# EAGLE design gps_sensor (EAGLE 9.2.0)
COMPANY: Fablab Santiago; DRAWN: Xavier; REV: A
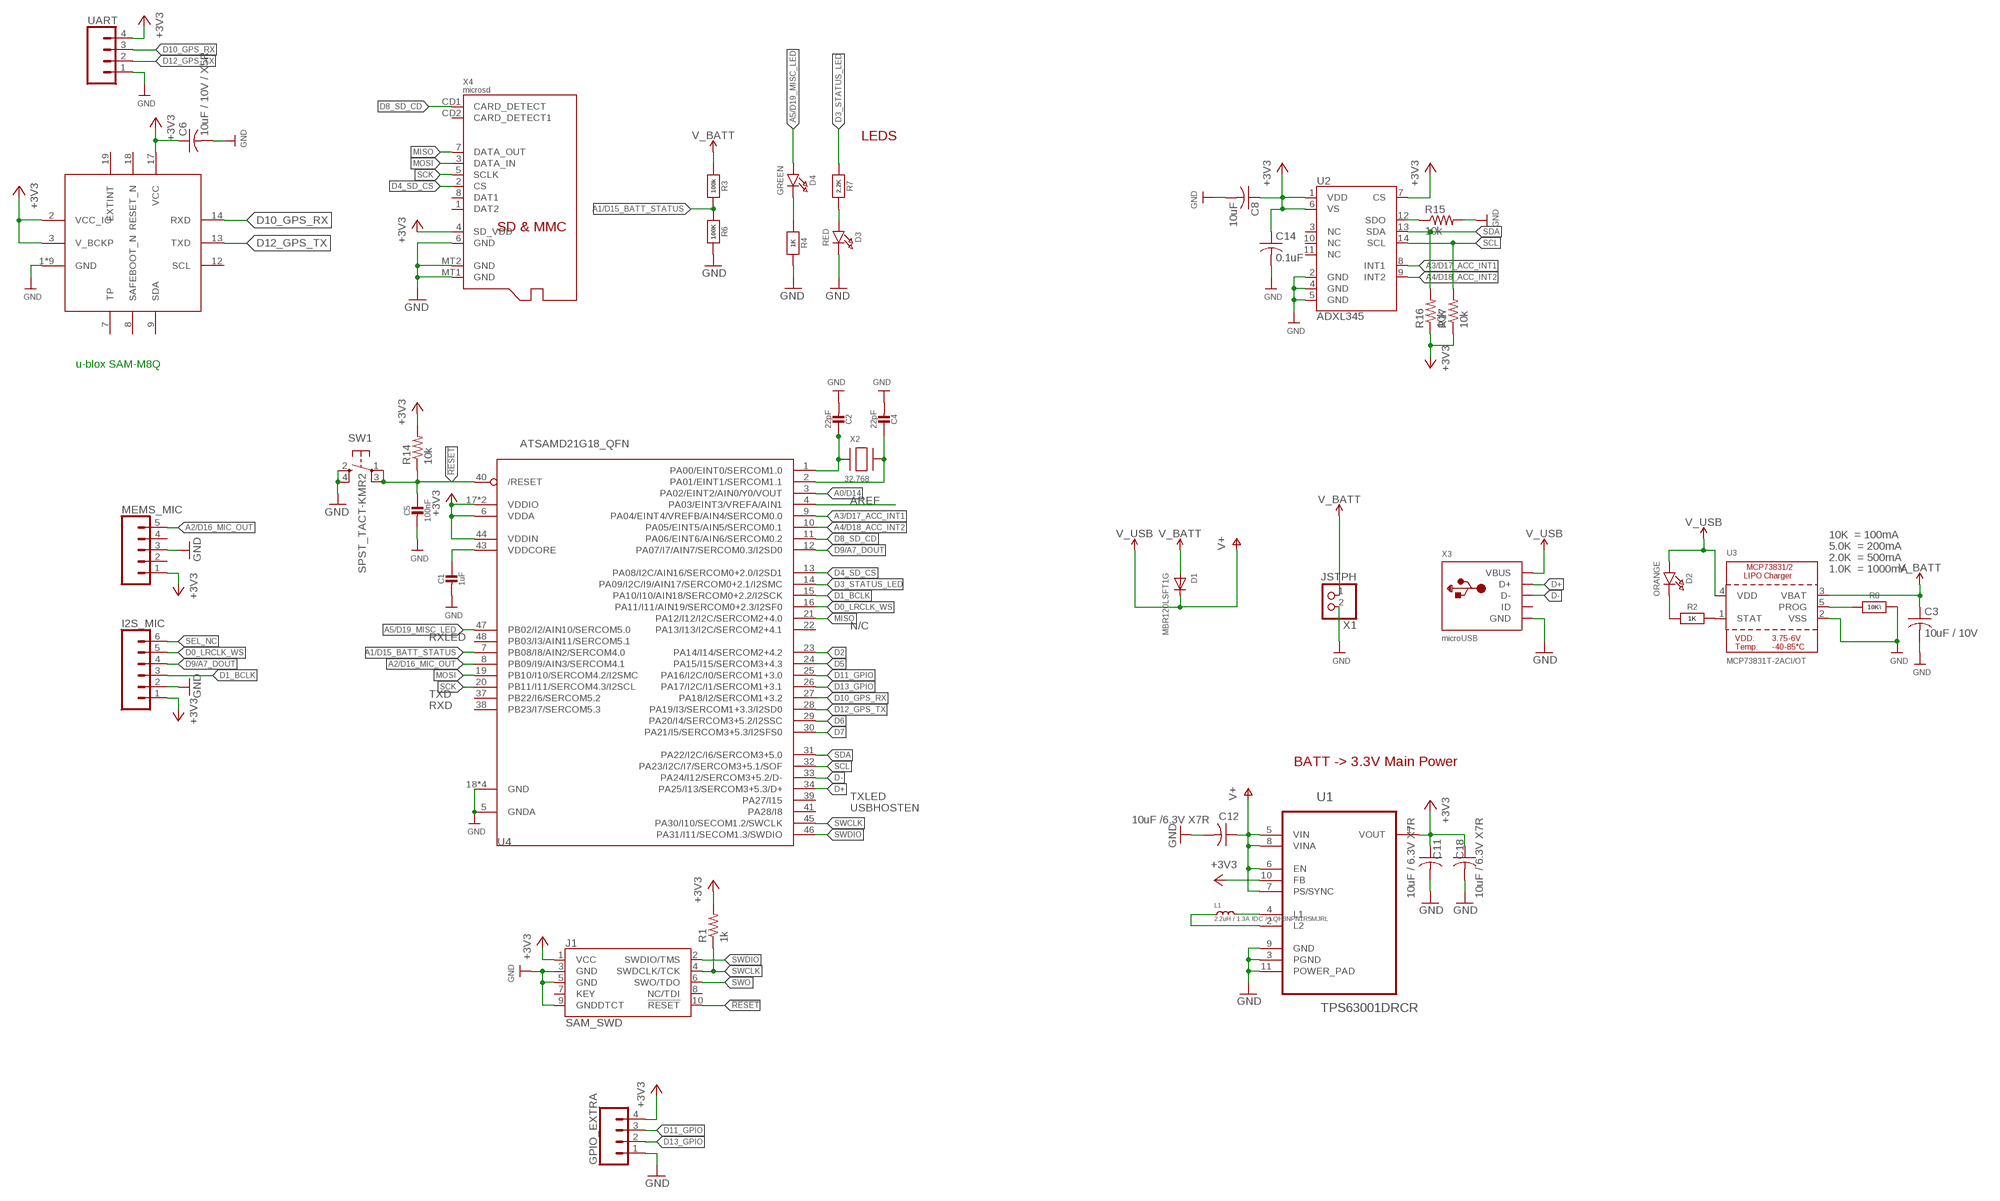
[diagram p0: schematic, sheet 1]

## Parts
C1  1uF  CAP_CERAMIC0603_NO  [0603-NO]
C2  22pF  CAP_CERAMIC0603_NO  [0603-NO]
C3  10uF / 10V  C-USC0603  [C0603]
C4  22pF  CAP_CERAMIC0603_NO  [0603-NO]
C5  100nF  CAP_CERAMIC0603_NO  [0603-NO]
C6  10uF / 10V / X5R  C-USC0603  [C0603]
C8  10uF  C-USC0603  [C0603]
C11  10uF / 6.3V X7R  C-USC0603  [C0603]
C12  10uF /6.3V X7R  C-USC0603  [C0603]
C14  0.1uF  C-USC0603  [C0603]
C18  10uF / 6.3V X7R  C-USC0603  [C0603]
D1  MBR120LSFT1G  DIODE_SOD-123FL  [SOD-123FL]
D2  ORANGE  LED0805_NOOUTLINE  [CHIPLED_0805_NOOUTLINE]
D3  RED  LED0805_NOOUTLINE  [CHIPLED_0805_NOOUTLINE]
D4  GREEN  LED0805_NOOUTLINE  [CHIPLED_0805_NOOUTLINE]
GPIO_EXTRA  CONN_04  [1X04]
I2S_MIC  CONN_06NO_SILK_NO_POP  [1X06_NO_SILK]
J1  SAM_SWD  CORTEX_DEBUG_SMD  [SAMTECH_FTSH-105-01]
L1  2.2uH / 1.3A IDC / LQH3NPN1R5MJRL  LQH3NPN___MM0  [LQH3NP_M0]
MEMS_MIC  CONN_05  [1X05]
R1  1k  R-US_R0603  [R0603]
R2  1K  RESISTOR_0603_NOOUT  [0603-NO]
R3  100k  RESISTOR_0603_NOOUT  [0603-NO]
R4  1K  RESISTOR_0603_NOOUT  [0603-NO]
R6  100K  RESISTOR_0603_NOOUT  [0603-NO]
R7  2.2K  RESISTOR_0603_NOOUT  [0603-NO]
R8  10K\  RESISTOR_0603_NOOUT  [0603-NO]
R14  10k  R-US_R0603  [R0603]
R15  10k  R-US_R0603  [R0603]
R16  10k  R-US_R0603  [R0603]
R17  10k  R-US_R0603  [R0603]
SW1  SPST_TACT-KMR2  [KMR2]
U1  TPS63001DRCR  [SON50P300X300X100-11N]
U2  ADXL345  [LGA-14]
U3  MCP73831T-2ACI/OT  MCP73831/2  [SOT23-5]
U4  ATSAMD21G18_QFN  ATSAMD21J_QFN  [TQFN48_7MM]
U5  SAM-M8Q  [SAM-M8Q]
UART  CONN_041X04_NO_SILK  [1X04_NO_SILK]
X1  JSTPH  JST_2PIN-SMT-RA  [JST-PH-2-SMT-RA]
X2  32.768  XTAL-3.2X1.5  [XTAL3215]
X3  microUSB  USB_MICRO_20329_V2  [4UCONN_20329_V2]
X4  microsd  MICROSD  [MICROSD]

## Nets
!RESET: C5.1 J1.10(!RESET) R14.1 SW1.1(P) SW1.3(P1) U4.40(/RESET)
+3V3: C6.1 C8.1 C11.1 C14.1 C18.1 GPIO_EXTRA.4 I2S_MIC.1 J1.1(VCC) MEMS_MIC.1 R1.2 R14.2 R16.1 R17.1 U1.1(VOUT) U1.10(FB) U2.1(VDD) U2.6(VS) U2.7(CS) U4.6(VDDA) U4.17(VDDIO) U4.36(VDDIO) U4.44(VDDIN) U5.2(VCC_IO) U5.3(V_BCKP) U5.17(VCC) UART.4 X4.4(SD_VDD)
A0/D14: U4.3(PA02/EINT2/AIN0/Y0/VOUT)
A1/D15_BATT_STATUS: R3.2 R6.1 U4.7(PB08/I8/AIN2/SERCOM4.0)
A2/D16_MIC_OUT: MEMS_MIC.5 U4.8(PB09/I9/AIN3/SERCOM4.1)
A3/D17_ACC_INT1: U2.8(INT1) U4.9(PA04/EINT4/VREFB/AIN4/SERCOM0.0)
A4/D18_ACC_INT2: U2.9(INT2) U4.10(PA05/EINT5/AIN5/SERCOM0.1)
A5/D19_MISC_LED: D4.A U4.47(PB02/I2/AIN10/SERCOM5.0)
AREF: U4.4(PA03/EINT3/VREFA/AIN1)
D0_LRCLK_WS: I2S_MIC.5 U4.16(PA11/I11/AIN19/SERCOM0+2.3/I2SF0)
D1_BCLK: I2S_MIC.3 U4.15(PA10/I10/AIN18/SERCOM0+2.2/I2SCK)
D2: U4.23(PA14/I14/SERCOM2+4.2)
D3_STATUS_LED: R7.1 U4.14(PA09/I2C/I9/AIN17/SERCOM0+2.1/I2SMC)
D4_SD_CS: U4.13(PA08/I2C/AIN16/SERCOM0+2.0/I2SD1) X4.2(CS)
D5: U4.24(PA15/I15/SERCOM3+4.3)
D6: U4.29(PA20/I4/SERCOM3+5.2/I2SSC)
D7: U4.30(PA21/I5/SERCOM3+5.3/I2SFS0)
D8_SD_CD: U4.11(PA06/EINT6/AIN6/SERCOM0.2) X4.CD1(CARD_DETECT)
D9/A7_DOUT: I2S_MIC.4 U4.12(PA07/I7/AIN7/SERCOM0.3/I2SD0)
D10_GPS_RX: U4.27(PA18/I2/SERCOM1+3.2) U5.14(RXD) UART.3
D11_GPIO: GPIO_EXTRA.3 U4.25(PA16/I2C/I0/SERCOM1+3.0)
D12_GPS_TX: U4.28(PA19/I3/SERCOM1+3.3/I2SD0) U5.13(TXD) UART.2
D13_GPIO: GPIO_EXTRA.2 U4.26(PA17/I2C/I1/SERCOM1+3.1)
D+: U4.34(PA25/I13/SERCOM3+5.3/D+) X3.D+
D-: U4.33(PA24/I12/SERCOM3+5.2/D-) X3.D-
GND: C1.2 C2.2 C3.2 C4.2 C5.2 C6.2 C8.2 C11.2 C12.2 C14.2 C18.2 D3.C GPIO_EXTRA.1 I2S_MIC.2 J1.3(GND) J1.5(GND) J1.9(GNDDTCT) MEMS_MIC.3 R4.2 R6.2 R8.2 R15.2 SW1.2(S) SW1.4(S1) U1.3(PGND) U1.9(GND) U1.11(POWER_PAD) U2.2(GND) U2.4(GND) U2.5(GND) U3.2(VSS) U4.5(GNDA) U4.18(GND) U4.35(GND) U4.42(GND) U4.THERMAL(GND) U5.1(GND) U5.4(GND) U5.5(GND) U5.6(GND) U5.10(GND) U5.11(GND) U5.15(GND) U5.16(GND) U5.20(GND) UART.1 X1.2 X3.BASE@1(GND) X3.BASE@2(GND) X3.GND X3.SPRT@1(GND) X3.SPRT@2(GND) X3.SPRT@3(GND) X3.SPRT@4(GND) X4.6(GND) X4.MT1(GND) X4.MT2(GND)
MISO: U4.21(PA12/I12/I2C/SERCOM2+4.0) X4.7(DATA_OUT)
MOSI: U4.19(PB10/I10/SERCOM4.2/I2SMC) X4.3(DATA_IN)
N$1: D2.C R2.1
N$2: D3.A R7.2
N$3: R2.2 U3.1(STAT)
N$4: R8.1 U3.5(PROG)
N$5: C2.1 U4.1(PA00/EINT0/SERCOM1.0) X2.P$1
N$6: D4.C R4.1
N$7: C4.1 U4.2(PA01/EINT1/SERCOM1.1) X2.P$2
N$9: L1.2 U1.4(L1)
N$10: L1.1 U1.2(L2)
N$14: R15.1 U2.12(SDO)
SCK: U4.20(PB11/I11/SERCOM4.3/I2SCL) X4.5(SCLK)
SCL: R17.2 U2.14(SCL) U4.32(PA23/I2C/I7/SERCOM3+5.1/SOF)
SDA: R16.2 U2.13(SDA) U4.31(PA22/I2C/I6/SERCOM3+5.0)
SEL_NC: I2S_MIC.6
SWCLK: J1.4(SWDCLK/TCK) R1.1 U4.45(PA30/I10/SECOM1.2/SWCLK)
SWDIO: J1.2(SWDIO/TMS) U4.46(PA31/I11/SECOM1.3/SWDIO)
SWO: J1.6(SWO/TDO)
V+: C12.1 D1.C D2.A U1.5(VIN) U1.6(EN) U1.7(PS/SYNC) U1.8(VINA) U3.4(VDD) X3.VBUS ; supply symbol labelled V_USB
V_BATT: C3.1 D1.A R3.1 U3.3(VBAT) X1.1
VDDCORE: C1.1 U4.43(VDDCORE)
Unconnected: J1.7(KEY) J1.8(NC/TDI) MEMS_MIC.2 MEMS_MIC.4 U2.3(NC) U2.10(NC) U2.11(NC) U4.22(PA13/I13/I2C/SERCOM2+4.1) U4.37(PB22/I6/SERCOM5.2) U4.38(PB23/I7/SERCOM5.3) U4.39(PA27/I15) U4.41(PA28/I8) U4.48(PB03/I3/AIN11/SERCOM5.1) U5.7(TP) U5.8(SAFEBOOT_N) U5.9(SDA) U5.12(SCL) U5.18(RESET_N) U5.19(EXTINT) X3.ID X4.1(DAT2) X4.8(DAT1) X4.CD2(CARD_DETECT1)

## Notes on the sheet
- LEDS
- u-blox SAM-M8Q
- 10K  = 100mA
- 5.0K  = 200mA
- 2.0K  = 500mA
- 1.0K  = 1000mA
- N/C
- RXLED
- TXD
- RXD
- BATT -> 3.3V Main Power
- TXLED
- USBHOSTEN

## Library data of the parts
C1 C2 C4 C5 = microbuilder:CAP_CERAMIC: Ceramic Capacitors For new designs, use the packages preceded by an '_' character since they are more reliable: The following footprints should be used on most boards: _0402 - Standard footprint for regular board layouts _0603 - Standard footprint for regular board layouts _0805 - Standard footprint for regular board layouts _1206 - Standard footprint for regular board layouts For extremely tight-pitch boards where space is at a premium, the following 'micro-pitch' footprints can be used (smaller pads, no silkscreen outline, etc.): _0402MP - Micro-pitch footprint for very dense/compact boards _0603MP - Micro-pitch footprint for very dense/compact boards _0805MP - Micro-pitch footprint for very dense/compact boards _1206MP - Micro-pitch footprint for very dense/compact boards
C3 C6 C8 C11 C12 C14 C18 = rcl:C-US: CAPACITOR, American symbol; SPICEPREFIX: C
D1 = adafruit:DIODE: Diode SMADIODE - SMA Surface Mount Package 20V 1A Schottky Diode Digikey: 641-1014-6-ND DO-1N4148 - Through Hole Small Current Diode SOD-123 20V 1 A (.5mV Vf) Schottky Diode - Digikey: MBRX120TPMSCT-ND SOD-323 10V 570mA (.38mV Vf, 3ns) Schottky Diode - Digikey: ZLLS410CT-ND SOD-523 30V 30mA Schottky Diode (RB751S-40TE61) - Digikey: RB751S-40TE61CT-ND SOT23-R/W - SOT23 Package (R = Solder Paste/Reflow Ovens, W = Hand-Soldering) BAT54Film 40V 300mA - Digikey: 497-7162-1-ND
D2-D4 = microbuilder:LED: LED 0603 - 0603 Surface Mount Package 2mA: Green LED - Low Power (3.9mcd, 2ma, 1.7Vf) - Digikey: 475-2709-2-ND Orange LED - Low Power (9.8mcd, 2ma, 1.8Vf) - Digikey: 475-1194-2-ND Red LED - Low Power (5mcd, 2ma, 1.8Vf) - Digikey: 475-1195-2-ND Yellow LED - Low Power (7mcd, 2ma, 1.8Vf) - Digikey: 475-1196-2-ND 5mA: Blue LED - Low Power (17mcd, 5ma, 2.9Vf) - Digikey: LNJ937W8CRACT-ND 0805 - 0805 Surface Mount Package 2mA: Red LED (8.8mcd, 2mA, 1.8Vf, Clear) - Low Power [Digikey: 475-2510-1-ND] Green LED (5mcd, 2mA, 1.8Vf, Clear) - Low Power [Digikey: 475-2730-1-ND] Yellow LED (11.3mcd, 2mA, 1.8Vf, Clear) - Low Power [Digikey: 475-2555-1-ND] 20mA: Red LED (104mcd, 20mA, Diffused) - LS R976 [Digikey: 475-1278-6-ND] Red LED (12mcd, 20mA, 2.0Vf, Clear) - APT2012EC [Digikey: 754-1128-1-ND] Green LED (15mcd, 20mA, 2.2Vf, Clear) - APT2012GC [Digikey: 754-1131-1-ND] Orange LED (160mcd, 20mA, 2.1Vf, Clear) - APT2012SECK [Digikey: 754-1130-1-ND] 1206 - 1206 Surface Mount Package Green LED (26mcd, 20mA, Diffused) - LG N971 [Digikey: 475-1407-6-ND] Red LED (15mcd, 20mA, Diffused) - LH N974 [Digikey: 475-1416-6-ND] Cree - Cree High-Power Surface Mount LEDs XPEBWT-L1-0000-00D50 - White 111lm 350mA 2.9Vf 6200K 110° XTEAWT-00-0000-00000LEE3 - White 114lm 350mA 2.85Vf 5000K 115° Everlight - Everlight 45-21 Series Surface Mount LEDs 45-21/QK2C-B2832AC2CB2/2T - Warm White 2000mcd 20mA 3.25Vf 3050K 120° 45-21/LK2C-B38452C4CB2/2T - Nuetral White 2000mcd 20mA 3.25Vf 4150K 120° 45-21/LK2C-B50634C6CB2/2T - Cold White 2200mcd 20mA 3.25Vf 5650K 120° PLCC2 Reverse Mount LS T77K-J1L2-1-0-2-R18-Z - Red 11.25mcd 2mA 1.8Vf 630nm 120° LO T77K-L1M2-24-Z - Orange 19.6mcd 2mA 1.8Vf 606nm 120° LY T77K-K2M1-26-Z - Yellow 15.7mcd 2mA 1.8Vf 587nm 120°
GPIO_EXTRA UART = SparkFun-Connectors:CONN_04: Multi connection point. Often used as Generic Header-pin footprint for 0.1 inch spaced/style header connections On any of the 0.1 inch spaced packages, you can populate with these: Break Away Headers - Straight <https://www.sparkfun.com/products/116> (PRT-00116) Break Away Male Headers - Right Angle <https://www.sparkfun.com/products/553> (PRT-00553) Female Headers <https://www.sparkfun.com/products/115> (PRT-00115) Break Away Headers - Machine Pin <https://www.sparkfun.com/products/117> (PRT-00117) Break Away Female Headers - Swiss Machine Pin <https://www.sparkfun.com/products/743> (PRT-00743) For SCREWTERMINALS and SPRING TERMINALS visit here: Screw Terimnals on SparkFun.com <https://www.sparkfun.com/search/results?term=Screw+Terminals> (5mm/3.5mm/2.54mm spacing) This device is also useful as a general connection point to wire up your design to another part of your project. Our various solder wires solder well into these plated through hole pads. Hook-Up Wire - Assortment (Stranded, 22 AWG) <https://www.sparkfun.com/products/11375> (PRT-11375) Hook-Up Wire - Assortment (Solid Core, 22 AWG) <https://www.sparkfun.com/products/11367> (PRT-11367) View the entire wire category on our website here <https://www.sparkfun.com/categories/141> Special notes: Molex polarized connector foot print use with SKU : PRT-08231 with associated crimp pins and housings. 1MM SMD Version SKU: PRT-10208; PROD_ID: CONN-09696
I2S_MIC = SparkFun-Connectors:CONN_06: Multi connection point. Often used as Generic Header-pin footprint for 0.1 inch spaced/style header connections On any of the 0.1 inch spaced packages, you can populate with these: Break Away Headers - Straight <https://www.sparkfun.com/products/116> (PRT-00116) Break Away Male Headers - Right Angle <https://www.sparkfun.com/products/553> (PRT-00553) Female Headers <https://www.sparkfun.com/products/115> (PRT-00115) Break Away Headers - Machine Pin <https://www.sparkfun.com/products/117> (PRT-00117) Break Away Female Headers - Swiss Machine Pin <https://www.sparkfun.com/products/743> (PRT-00743) Arduino Stackable Header - 6 Pin <https://www.sparkfun.com/products/9280> (PRT-09280) For SCREWTERMINALS and SPRING TERMINALS visit here: Screw Terimnals on SparkFun.com <https://www.sparkfun.com/search/results?term=Screw+Terminals> (5mm/3.5mm/2.54mm spacing) This device is also useful as a general connection point to wire up your design to another part of your project. Our various solder wires solder well into these plated through hole pads. Hook-Up Wire - Assortment (Stranded, 22 AWG) <https://www.sparkfun.com/products/11375> (PRT-11375) Hook-Up Wire - Assortment (Solid Core, 22 AWG) <https://www.sparkfun.com/products/11367> (PRT-11367) View the entire wire category on our website here <https://www.sparkfun.com/categories/141>
J1 = SparkFun-Connectors:CORTEX_DEBUG: Cortex Debug Connector - 10 pin Supports JTAG debug, Serial Wire debug, and Serial Wire Viewer. PTH and SMD connector options available. General Connector Information <http://infocenter.arm.com/help/topic/com.arm.doc.faqs/attached/13634/cortex_debug_connectors.pdf> Products: PTH Connector <http://www.digikey.com/product-detail/en/cnc-tech/3220-10-0100-00/1175-1627-ND/3883661> -via Digi-Key SparkFun PSoc <https://www.sparkfun.com/products/13229> SparkFun T <https://www.sparkfun.com/products/13810>
L1 = murata:LQH3NPN___MM0
MEMS_MIC = SparkFun-Connectors:CONN_05: Multi connection point. Often used as Generic Header-pin footprint for 0.1 inch spaced/style header connections On any of the 0.1 inch spaced packages, you can populate with these: Break Away Headers - Straight <https://www.sparkfun.com/products/116> (PRT-00116) Break Away Male Headers - Right Angle <https://www.sparkfun.com/products/553> (PRT-00553) Female Headers <https://www.sparkfun.com/products/115> (PRT-00115) Break Away Headers - Machine Pin <https://www.sparkfun.com/products/117> (PRT-00117) Break Away Female Headers - Swiss Machine Pin <https://www.sparkfun.com/products/743> (PRT-00743) For SCREWTERMINALS and SPRING TERMINALS visit here: Screw Terimnals on SparkFun.com <https://www.sparkfun.com/search/results?term=Screw+Terminals> (5mm/3.5mm/2.54mm spacing) This device is also useful as a general connection point to wire up your design to another part of your project. Our various solder wires solder well into these plated through hole pads. Hook-Up Wire - Assortment (Stranded, 22 AWG) <https://www.sparkfun.com/products/11375> (PRT-11375) Hook-Up Wire - Assortment (Solid Core, 22 AWG) <https://www.sparkfun.com/products/11367> (PRT-11367) View the entire wire category on our website here <https://www.sparkfun.com/categories/141> Special notes: Molex polarized connector foot print use with SKU : PRT-08231 with associated crimp pins and housings. 1MM SMD Version SKU: PRT-10208
R1 R14-R17 = rcl:R-US_: RESISTOR, American symbol; SPICEPREFIX: R
R2-R4 R6-R8 = microbuilder:RESISTOR: Resistors For new designs, use the packages preceded by an '_' character since they are more reliable: The following footprints should be used on most boards: _0402 - Standard footprint for regular board layouts _0603 - Standard footprint for regular board layouts _0805 - Standard footprint for regular board layouts _1206 - Standard footprint for regular board layouts For extremely tight-pitch boards where space is at a premium, the following 'micro-pitch' footprints can be used (smaller pads, no silkscreen outline, etc.): _0402MP - Micro-pitch footprint for very dense/compact boards _0603MP - Micro-pitch footprint for very dense/compact boards _0805MP - Micro-pitch footprint for very dense/compact boards _1206MP - Micro-pitch footprint for very dense/compact boards
SW1 = adafruit:SPST_TACT: SMT 6mm switch, EVQQ2 series http://www.ladyada.net/library/eagle
U1 = Texas Instruments_By_element14_Batch_1:TPS63001DRCR: HIGH EFFICIENT SINGLE INDUCTOR BUCK-BOOST CONVERTER WITH 1.8-A SWITCHES; MPN: TPS63001DRCR; OC_FARNELL: -; OC_NEWARK: 85K1711; PACKAGE: SON-10; SUPPLIER: TEXAS INSTRUMENTS
U2 = SparkFun-Sensors:ADXL345: Analog Devices ADXL345 3-Axis SPI/I2C 2/4/8/16g Accelerometer The ADXL345 is a small, thin, low power, 3-axis accelerometer with high resolution (13-bit) measurement at up to ±16g. Digital output data is formatted as 16-bit twos complement and is accessible through either a SPI (3- or 4-wire) or I2C digital interface. Datasheet <https://www.sparkfun.com/datasheets/Sensors/Accelerometer/ADXL345.pdf> SparkFun Products SparkFun Triple Axis Accelerometer Breakout - ADXL345 <https://www.sparkfun.com/products/9836> (SEN-09836) Triple Axis Accelerometer - ADXL345 <https://www.sparkfun.com/products/9045> (SEN-09045) SparkFun 6 Degrees of Freedom IMU Digital Combo Board - ITG3200/ADXL345 <https://www.sparkfun.com/products/10121> (SEN-10121); PROD_ID: IC-09097; SF_ID: SEN-09045
U3 = microbuilder:MCP73831/2: MCP73831/2 LIPO Charger VDD: 3.75 - 6V Temp -40 - 85°C Programmable Charge Rate: 15-500mA NOTE: STAT is a tri-state logic output on the MCP73831 and an open-drain output on the MCP73832. SOT23-5 with 4.2V output and tri-state logic on STAT = MCP73831T-2ACI/OT
U4 = microbuilder:ATSAMD21J
U5 = ubloxLib:SAM-M8Q: u-blox SAM GNSS antenna module
X1 = adafruit:JST_2PIN: JST 2-Pin Connectors of various flavors SMT-RA (S2B-PH-SM4) 4UConnector #17311 SMT (B2B-PH-SM4) THM-RA (S2B-PH) THM (B2B-PH)
X2 = adafruit2:XTAL: Low cost SMT crystals, no capacitors included http://www.ladyada.net/library/eagle
X3 = microbuilder:USB: USB Connectors USBMINIB - Surface Mount Female Mini-B USB Connector 4UConnector: 06564
X4 = microbuilder:MICROSD: MicroSD/Transflash Card Holder with SPI pinout 3M: 2908-05WB-MG 4UConnector: 19656 Footprint courtesy: Adafruit Industries

## Board
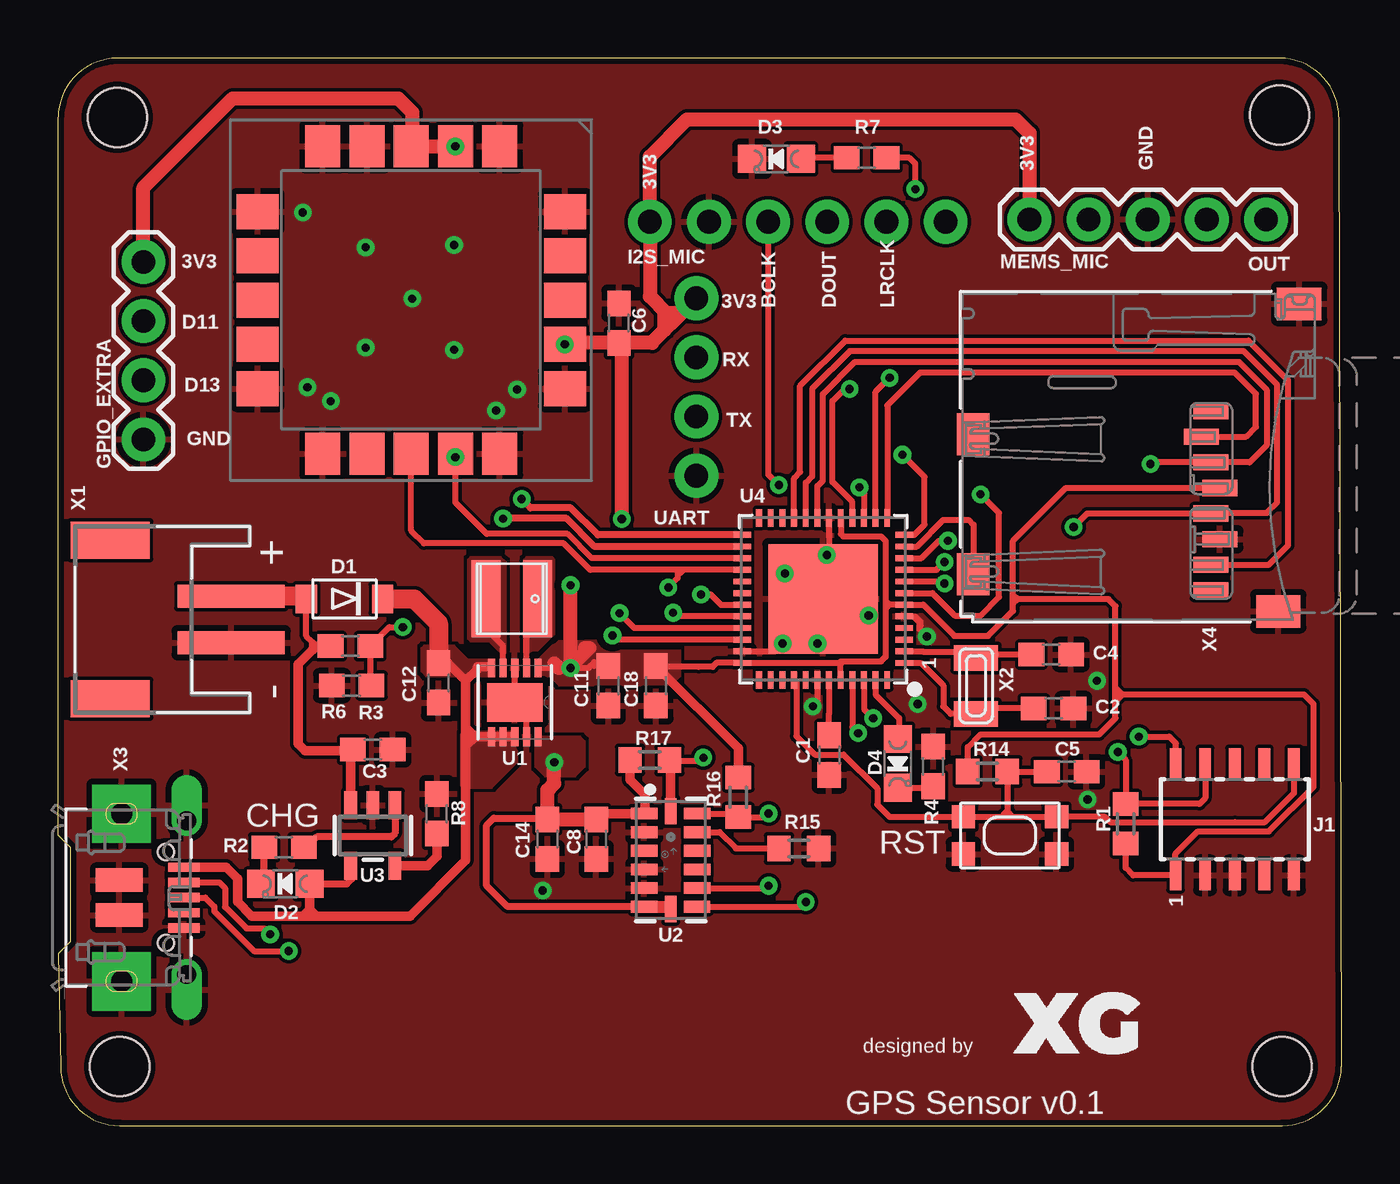
[diagram p1: board, top side]
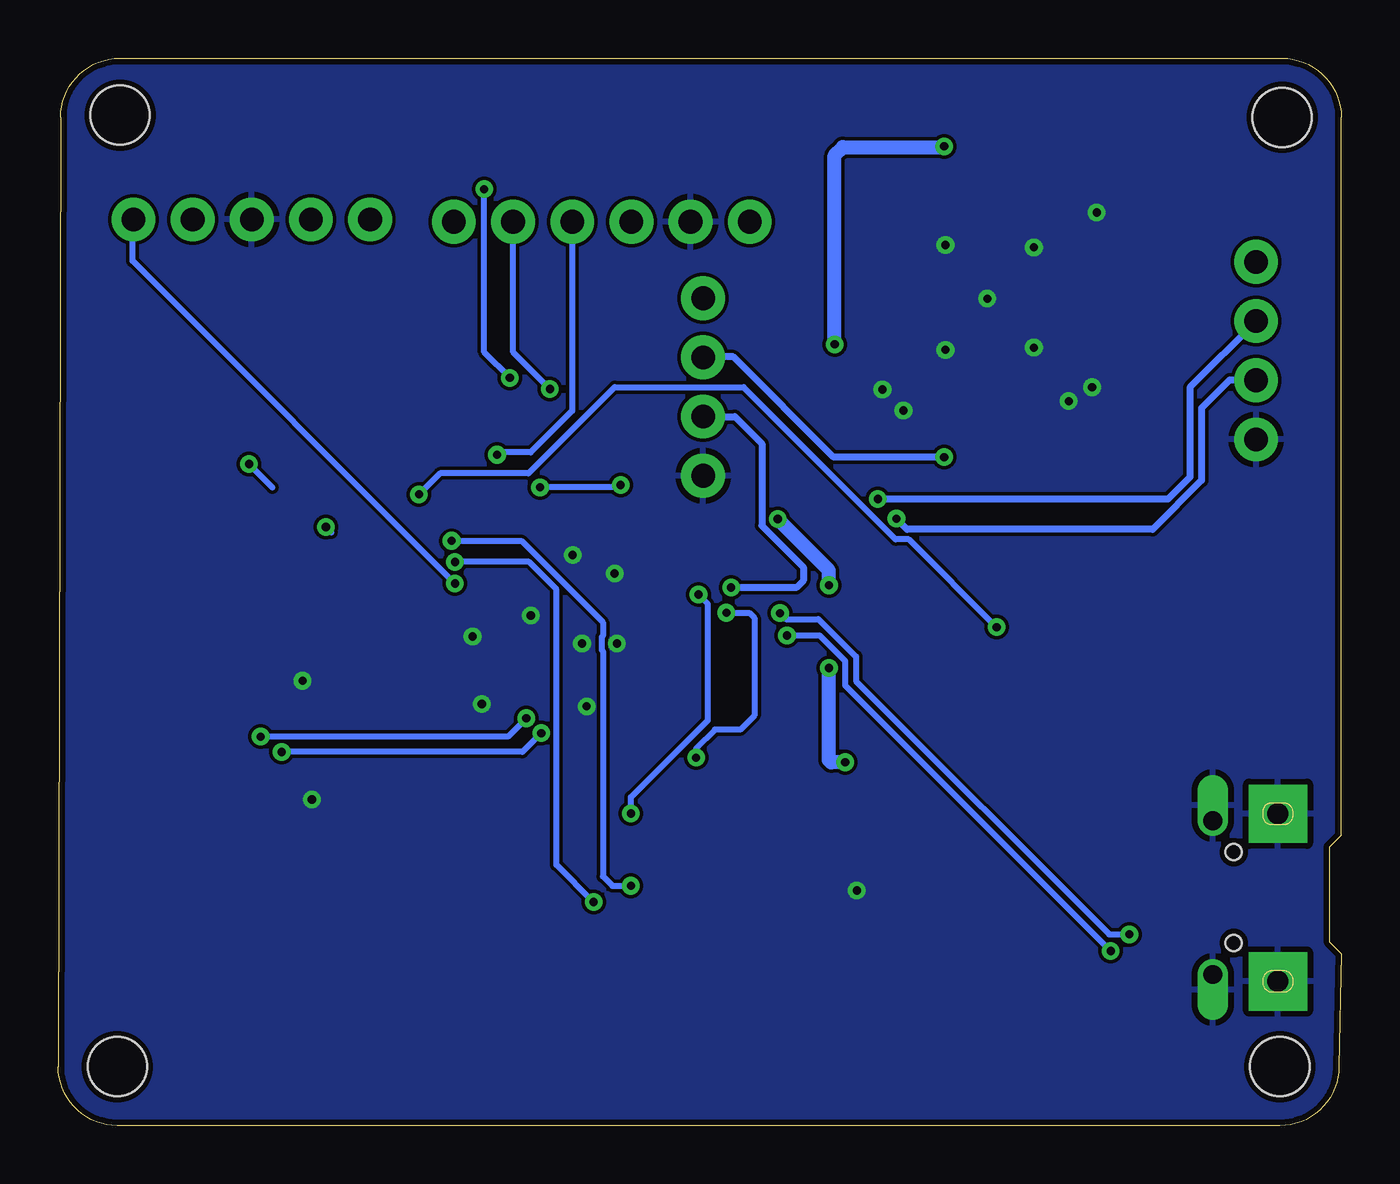
[diagram p2: board, bottom side, seen from below]

Size 55.09 x 45.82 mm. Coordinates in mm from the lower left corner, seen from the top.
Outline: 2.64,0 52.55,0 arc90 55.09,2.54 54.99,43.28 arc90 52.45,45.82 2.54,45.82 arc90 0,43.28 0,12.47 0.51,11.96 0.51,7.9 0,7.39 0.1,2.54 arc90 2.64,0
Copper layers (1*16): Top 0.035mm / dielectric 1.5mm / Bottom 0.035mm
Design rules "adafruit *": minimum track width 10mil, minimum drill 0.3mm, track to track 0.15mm, track to pad 0.15mm, pad to pad 0.15mm, via to via 0.15mm, smd to smd 0.15mm, copper to edge 10mil, drill to drill 8mil, minimum pad ring 10mil, minimum via ring 8mil, stop-mask expansion 2mil, vias tented up to drill 20mil, thermal gap 10mil
Holes 2.54 mm at 52.55,2.54 2.54,43.28 2.64,2.54 52.44,43.38

### Footprints (pad centres in the part's own frame; a part is rotated, then mirrored left to right if it is on the bottom)
0603-NO = smd 1.1 x 1: 1 -0.85,0; 2 0.85,0
C0603 = smd 1.1 x 1: 1 -0.85,0; 2 0.85,0
SOD-123FL = smd 0.91 x 1.22: A 1.637,0; C -1.637,0
CHIPLED_0805_NOOUTLINE = smd 1.2 x 1.2: A 0,-1.05; C 0,1.05
1X04 = drill 1.016 pad 1.88: 1 0,0; 2 2.54,0; 3 5.08,0; 4 7.62,0
1X06_NO_SILK = drill 1.016 pad 1.88: 1 0,0; 2 2.54,0; 3 5.08,0; 4 7.62,0; 5 10.16,0; 6 12.7,0
SAMTECH_FTSH-105-01 = smd 0.508 x 1.27: 1 -2.54,-2.413; 2 -2.54,2.413; 3 -1.27,-2.413; 4 -1.27,2.413; 5 0,-2.413; 6 0,2.413; 7 1.27,-2.413; 8 1.27,2.413; 9 2.54,-2.413; 10 2.54,2.413
LQH3NP_M0 = smd 1.25 x 3.3: 1 -1.1,0; 2 1.1,0
1X05 = drill 1.016 pad 1.88: 1 0,0; 2 2.54,0; 3 5.08,0; 4 7.62,0; 5 10.16,0
R0603 = smd 1 x 1.1: 1 -0.85,0; 2 0.85,0
KMR2 = smd 1 x 1: 1 2,0.8; 2 2,-0.8; 3 -2,0.8; 4 -2,-0.8
SON50P300X300X100-11N = smd 0.813 x 0.305: 1 -1.473,0.991; 2 -1.473,0.508; 3 -1.473,0; 4 -1.473,-0.508; 5 -1.473,-0.991; 6 1.473,-0.991; 7 1.473,-0.508; 8 1.473,0; 9 1.473,0.508; 10 1.473,0.991 | smd 1.651 x 2.388: 11 0,0
LGA-14 = smd 0.5 x 1.124: 1 2,1.138; 2 1.2,1.138; 3 0.4,1.138; 4 -0.4,1.138; 5 -1.2,1.138; 6 -2,1.138; 8 -2,-1.13; 9 -1.2,-1.138; 10 -0.4,-1.138; 11 0.4,-1.138; 12 1.2,-1.138; 13 2,-1.138 | smd 1.124 x 0.5: 7 -2.1,0; 14 2.1,0
SOT23-5 = smd 0.55 x 1.2: 1 -0.95,-1.3; 2 0,-1.3; 3 0.95,-1.3; 4 0.95,1.3; 5 -0.95,1.3
TQFN48_7MM = smd 0.25 x 0.75: 1 -2.75,-3.475; 2 -2.25,-3.475; 3 -1.75,-3.475; 4 -1.25,-3.475; 5 -0.75,-3.475; 6 -0.25,-3.475; 7 0.25,-3.475; 8 0.75,-3.475; 9 1.25,-3.475; 10 1.75,-3.475; 11 2.25,-3.475; 12 2.75,-3.475; 25 2.75,3.475; 26 2.25,3.475; 27 1.75,3.475; 28 1.25,3.475; 29 0.75,3.475; 30 0.25,3.475; 31 -0.25,3.475; 32 -0.75,3.475; 33 -1.25,3.475; 34 -1.75,3.475; 35 -2.25,3.475; 36 -2.75,3.475 | smd 0.75 x 0.25: 13 3.475,-2.75; 14 3.475,-2.25; 15 3.475,-1.75; 16 3.475,-1.25; 17 3.475,-0.75; 18 3.475,-0.25; 19 3.475,0.25; 20 3.475,0.75; 21 3.475,1.25; 22 3.475,1.75; 23 3.475,2.25; 24 3.475,2.75; 37 -3.475,2.75; 38 -3.475,2.25; 39 -3.475,1.75; 40 -3.475,1.25; 41 -3.475,0.75; 42 -3.475,0.25; 43 -3.475,-0.25; 44 -3.475,-0.75; 45 -3.475,-1.25; 46 -3.475,-1.75; 47 -3.475,-2.25; 48 -3.475,-2.75 | smd 4.7 x 4.7: THERMAL 0,0
SAM-M8Q = smd 1.8 x 1.5: 1 -6.6,3.8; 2 -6.6,1.9; 3 -6.6,0; 4 -6.6,-1.9; 5 -6.6,-3.8; 11 6.6,-3.8; 12 6.6,-1.9; 13 6.6,0; 14 6.6,1.9; 15 6.6,3.8 | smd 1.5 x 1.8: 6 -3.8,-6.6; 7 -1.9,-6.6; 8 0,-6.6; 9 1.9,-6.6; 10 3.8,-6.6; 16 3.8,6.6; 17 1.9,6.6; 18 0,6.6; 19 -1.9,6.6; 20 -3.8,6.6
1X04_NO_SILK = drill 1.016 pad 1.88: 1 0,0; 2 2.54,0; 3 5.08,0; 4 7.62,0
JST-PH-2-SMT-RA = smd 1 x 4.6: 1 1,-3.7; 2 -1,-3.7 | smd 1.6 x 3.4: NC1 -3.4,1.5; NC2 3.4,1.5
XTAL3215 = smd 1.1 x 1.9: P$1 1.2,0; P$2 -1.2,0
4UCONN_20329_V2 = smd 1 x 2: BASE@1 -0.75,-2; BASE@2 0.75,-2 | smd 0.4 x 1.35: D+ 0,0.775; D- -0.65,0.775; GND 1.3,0.775; ID 0.65,0.775; VBUS -1.3,0.775 | drill 0.8 pad 1.2 offset: SPRT@1 -3.3,0.9; SPRT@2 3.3,0.9 | drill 0.9 pad 2.5 square: SPRT@3 -3.6,-1.9; SPRT@4 3.6,-1.9 | hole 0.7: -1.95,0; 1.95,0
MICROSD = smd 0.7 x 1.5: 1 9,-10.64; 2 7.9,-10.24; 3 6.8,-10.64; 4 5.7,-11.04; 5 4.6,-10.64; 6 3.5,-11.04; 7 2.4,-10.64; 8 1.3,-10.64 | smd 1.8 x 1.4: CD1 2,-0.44; CD2 8,-0.44 | smd 1.4 x 1.9: MT1 0.4,-13.54; MT2 13.6,-14.44

### Placement (x,y rotation side)
C1  33.1,15.91 270 top
C2  42.73,17.91 0 top
C3  13.51,16.14 0 top
C4  42.63,20.22 0 top
C5  43.3,15.2 0 top
C6  24.08,34.45 90 top
C8  23.1,12.3 270 top
C11  23.62,18.89 270 top
C12  16.33,19.01 270 top
C14  21,12.3 270 top
C18  25.66,18.89 270 top
D1  12.29,22.62 180 top
D2  9.75,10.38 90 top
D3  30.84,41.5 90 top
D4  36.05,15.55 180 top
GPIO_EXTRA  3.66,29.46 90 top
I2S_MIC  25.4,38.8 0 top
J1  50.52,13.16 0 top
L1  19.48,22.62 180 top
MEMS_MIC  41.7,38.9 0 top
R1  45.84,12.96 270 top
R2  9.7,11.95 0 top
R3  12.55,20.59 0 top
R4  37.57,15.42 90 top
R6  12.6,18.89 180 top
R7  34.71,41.55 180 top
R8  16.26,13.39 90 top
R14  39.9,15.2 180 top
R15  31.8,11.9 0 top
R16  29.2,14.1 270 top
R17  25.4,15.7 0 top
SW1  40.86,12.46 0 top
U1  19.6,18.18 270 top
U2  26.3,11.4 90 top
U3  13.51,12.46 180 top
U4  32.84,22.61 90 top
U5  15.15,35.44 270 top
UART  27.4,27.9 90 top
X1  3.73,21.73 90 top
X2  39.41,18.88 270 top
X3  4.62,9.79 270 top
X4  38.84,21.68 90 top

### Tracks (layer width: path | path; a pad name or v marks a point on that pad's centre or on a via)
!RESET
  Top 0.254: C5.1 R14.1 40.75,13.51 | 40.6,13.26 SW1.3 35.7,13.26 35.17,13.79 35.17,14.48 33.72,15.93 32.49,15.93 31.69,16.73 31.69,19.04 U4.40 | 40.6,13.26 40.8,13.26 | 40.8,13.26 41,13.26 | 41,13.26 SW1.1 44.95,13.26 45.17,13.04 50.53,13.04 51.82,13.04 53.07,14.29 53.07,15.56 J1.10 | 40.75,13.51 40.75,13.31 40.8,13.26 | 40.75,13.51 41,13.26 | 40.75,13.51 40.6,13.36 40.6,13.26
+3V3  (via drill 0.35)
  Top 0.254: 23.03,19.74 23.03,19.9 22.78,19.65 v22,19.65 21.5,19.65 U1.1 | U1.10 | U4.44 33.59,19.8 33.6,19.8 33.54,19.86 | 33.54,19.86 U4.36 28.26,19.86 28.09,19.69 27.51,19.69 27.5,19.7 25.7,19.7 C18.1 | 33.54,19.86 33.61,19.93 35.33,19.93 35.52,20.12 35.52,22.2 | U4.17 33.6,25.4 33.71,25.29 35.33,25.29 35.52,25.1 35.52,22.54 | 35.52,22.54 35.52,22.4 | 35.52,22.4 35.52,22.2 | 35.52,22.4 35.56,22.36 35.69,22.36 | 35.7,22.36 U4.6 37.14,22.36 38.47,21.03 39.93,21.03 41,22.1 41,22.4 | 35.52,22.54 35.7,22.36 | 35.52,22.2 35.69,22.36 | 35.69,22.36 35.7,22.36 | X4.4 43.27,27.38 41,25.1 41,22.8 | 41,22.4 41,22.6 | 41,22.6 41,22.8 | R14.2 39.05,16.25 39.6,16.8 44.7,16.8 45.4,17.5 45.4,18.2 | 41.2,22.6 45.1,22.6 45.4,22.3 45.4,18.8 | 41.2,22.6 41,22.6 | 45.4,18.2 45.4,18.5 | 45.4,18.5 45.4,18.8 | 41,22.4 41.2,22.6 | 41,22.8 41.2,22.6 | R1.2 45.84,11.06 46.15,10.75 J1.1 47.98,11.68 48.93,12.63 51.98,12.63 53.9,14.55 53.9,18.1 53.5,18.5 45.7,18.5 | 45.7,18.5 45.4,18.5 | 45.4,18.8 45.7,18.5 | 45.4,18.2 45.7,18.5
  Top 0.305: U2.6 19.3,9.4 18.4,10.3 18.4,12.9 18.7,13.2 20.95,13.2 C14.1
  Top 0.406: C8.1 23.35,13.4 U2.1 25.2,13.44 25.2,14.2 24.55,14.85 R17.1 | 25.7,19.7 29.2,16.2 R16.1
  Top 0.508: U2.6 26.2,9.4 U2.7
  Top 0.61: U5.2 U5.3 15.2,42.08 15.2,43.5 14.6,44.1 7.5,44.1 3.66,40.26 GPIO_EXTRA.4 | v21.3,15.6 21.3,14.7 21,14.4 C14.1 C8.1 | 22.6,20.5 22.8,20.5 22,19.7 v22,19.65 v22,23.2 | 21.3,19.85 21.5,19.65 | C6.1 21.82,33.6 U5.17 | v24.2,26.04 24.2,33.48 C6.1 | C6.1 25.5,33.6 25.5,33.62 26.04,34.16 | UART.4 26.78,34.9 | 26.78,34.9 26.44,34.56 | 26.44,34.56 26.04,34.16 | 26.1,34.9 25.4,35.6 I2S_MIC.1 25.4,41.6 27,43.2 41.1,43.2 41.7,42.6 MEMS_MIC.1 | 26.1,34.9 26.44,34.56 | 26.04,34.16 26.04,34.84 26.1,34.9 | 26.1,34.9 26.78,34.9
  Bottom 0.254: 21.9,15.6 22,15.7
  Bottom 0.61: v21.3,15.6 21.9,15.6 | 22,15.7 v22,19.65 | U5.17 21.75,41.65 21.4,42 17.09,42 U5.2 | v22,23.2 22,23.84 v24.2,26.04
  other vias: 21.75,33.54 17.05,42.04
  pour Top (isolate 0.305, no thermals): 20.5,19.4 20.5,19.9 21.4,20.8 21.7,20.8 26.2,20.9 26.7,20.4 26.7,19.3 26.3,18.9 21.5,18.9 21.1,19.3 20.6,19.3
  pour Top (no thermals): 20.5,16.7 20.5,15.4 20.9,15 22.2,15 22.6,15.4 22.6,16.5 22.4,16.7
A1/D15_BATT_STATUS  (via drill 0.35)
  Top 0.254: R6.1 13.4,18.95 R3.2 14.21,21.4 v14.8,21.4 | U4.7 37.54,22.86 38.5,21.9 39.6,21.9 40.4,22.7 40.4,26.3 v39.6,27.1
  Bottom 0.254: v14.8,21.4 18.57,25.17 19.14,25.17 25.67,31.7 31.2,31.7 34.9,28 38.7,28 v39.6,27.1
A2/D16_MIC_OUT  (via drill 0.35)
  Top 0.254: U4.8 37.97,23.36 v38.05,23.27
  Bottom 0.254: v38.05,23.27 51.9,37.12 51.9,38.86 MEMS_MIC.5
A3/D17_ACC_INT1  (via drill 0.35)
  Top 0.254: U4.9 37.72,23.86 v38.05,24.2 | U2.8 31.9,9.4 v32.1,9.6
  Bottom 0.254: v32.1,9.6 33.7,11.2 33.7,23.02 34.87,24.2 v38.05,24.2
A4/D18_ACC_INT2  (via drill 0.35)
  Top 0.254: U4.10 37.06,24.36 37.81,25.11 v38.2,25.11 | U2.9 30.4,10.2 v30.5,10.3
  Bottom 0.254: v38.2,25.11 35.21,25.11 31.7,21.6 31.7,21.03 31.76,20.97 31.76,20.43 31.7,20.37 31.7,10.7 31.3,10.3 v30.5,10.3
A5/D19_MISC_LED
  Top 0.254: U4.47 35.09,18.5 36.1,17.5 36.1,16.65 D4.A
D0_LRCLK_WS  (via drill 0.35)
  Top 0.254: U4.16 34.09,26.78 33.23,27.64 33.23,31.1 33.76,31.62 v33.98,31.62
  Bottom 0.254: v33.98,31.62 35.56,33.2 I2S_MIC.5
D1_BCLK  (via drill 0.35)
  Top 0.254: I2S_MIC.3 30.48,27.96 v30.94,27.5 | v34.4,27.4 34.59,27.2 U4.15
  Bottom 0.254: v30.94,27.5 31.04,27.4 v34.4,27.4
D3_STATUS_LED  (via drill 0.35)
  Top 0.254: U4.14 35.09,31.5 v35.7,32.1 | v36.8,40.2 36.8,41.3 36.55,41.55 R7.1
  Bottom 0.254: v35.7,32.1 36.8,33.2 v36.8,40.2
D4_SD_CS
  Top 0.254: X4.2 51,29.57 51.43,30 51.43,31.41 50.51,32.33 37,32.33 35.59,30.92 U4.13
D8_SD_CD
  Top 0.254: U4.11 36.86,24.86 38,26 39.1,26 39.3,25.8 39.3,23.69 X4.CD1
D9/A7_DOUT  (via drill 0.35)
  Top 0.254: U4.12 36.76,25.36 37.2,25.8 37.2,27.85 v36.25,28.8
  Bottom 0.254: v36.25,28.8 36.15,28.9 34.8,28.9 33.02,30.68 I2S_MIC.4
D10_GPS_RX  (via drill 0.35)
  Top 0.254: U4.27 22.91,24.36 21.87,25.4 18.4,25.4 17.05,26.75 v17.05,28.7
  Top 0.305: U5.14 v17.05,28.7
  Bottom 0.305: v17.05,28.7 21.8,28.7 26.1,33 27.38,33 UART.3
D11_GPIO  (via drill 0.35)
  Top 0.305: U4.25 23.17,25.36 22.01,26.52 20.28,26.52 v19.9,26.9
  Bottom 0.305: GPIO_EXTRA.3 6.5,31.7 6.5,27.84 7.44,26.9 v19.9,26.9
D12_GPS_TX  (via drill 0.35)
  Top 0.254: U4.28 26.8,23.86 | 26.8,23.86 26.6,23.86 | 26.6,23.86 22.84,23.86 21.7,25 15.7,25 15.15,25.55 U5.13 | 26.6,23.86 26.6,23.6 | 26.6,23.6 26.6,23.5 v26.2,23.1 | 26.6,23.6 26.8,23.8 26.8,23.86
  Bottom 0.305: UART.2 26.04,30.44 24.88,29.28 24.88,25.76 23.1,23.98 23.1,23.4 23.4,23.1 v26.2,23.1
D13_GPIO  (via drill 0.35)
  Top 0.305: U4.26 23.03,24.86 21.82,26.07 v19.11,26.07 v19.1,26.06
  Bottom 0.305: GPIO_EXTRA.2 4.8,32 6,30.8 6,27.7 8.1,25.6 18.64,25.6 v19.1,26.06
D+  (via drill 0.35)
  Top 0.254: U4.34 23.98,20.86 v23.8,21.04 | X3.D+ 6.31,9.79 6.71,9.4 6.71,9.21 8.41,7.5 v9.9,7.5
  Bottom 0.254: v9.9,7.5 21.29,18.89 21.29,19.94 22.39,21.04 v23.8,21.04
D-  (via drill 0.35)
  Top 0.254: U4.33 26,21.36 25.99,21.36 24.74,21.36 v24.1,22 | X3.D- 6.92,10.44 7.16,10.2 7.16,9.39 8.09,8.47 8.85,8.47 v9.1,8.21
  Bottom 0.254: v9.1,8.21 9.97,8.21 20.83,19.08 20.83,20.13 22.45,21.75 23.85,21.75 v24.1,22
GND  (via drill 0.35)
  Top 0.254: U1.3 U1.11 20.11,17.67 U1.9 | U4.42 32.59,18.2 v32.4,18 | U4.18 33.09,24.59 v33,24.5 32.84,24.34 U4.THERMAL 31.1,20.87 v31.1,20.7 30.76,20.36 U4.35 | 37.02,21.48 37.02,21.62 36.79,21.86 U4.5 36.71,21.86 36.97,21.6 36.97,21.33 v37.3,21
  other vias: 17,37.8 17,33.3 19.7,31.6 18.8,30.7 15.2,35.5 10.5,39.2 13.2,33.4 10.7,31.7 11.7,31.1 13.2,37.7 31.2,23.7 34.8,21.9 32.6,20.7 20.8,10.1 44.2,14 44.6,19.1 36.9,18.1
  pour Bottom: 55.09,0 0.1,0 -0.2,45.82 54.79,45.82
  pour Top (rank 2): 0.1,0 0,45.82 54.99,45.69 55.09,-0.13
MISO
  Top 0.254: X4.7 51.98,24.07 52.8,24.9 52.8,32 51.1,33.7 33.8,33.7 31.86,31.76 31.86,28.06 31.6,27.8 U4.21
MOSI  (via drill 0.35)
  Top 0.254: U4.19 32.59,27.45 32.83,27.68 32.83,31.4 34.22,32.79 50.7,32.79 51.89,31.6 51.89,29.2 51.16,28.48 X4.3 46.98,28.48 v46.9,28.4
  Bottom 0.254: v46.9,28.4 45.89,27.39
N$1
  Top 0.305: D2.C 8.85,10.53 R2.1
N$2
  Top 0.254: R7.2 31.94,41.55 D3.A
N$3
  Top 0.305: U3.1 14.46,12.56 14.3,12.4 11.1,12.4 10.65,11.95 R2.2
N$4
  Top 0.406: U3.5 15.86,11.16 16.26,11.56 R8.1
N$5
  Top 0.254: U4.1 37.04,19.86 38,18.9 38,18 38.32,17.68 X2.P$1 39.64,17.91 C2.1
N$6
  Top 0.254: D4.C 37.5,14.5 R4.1
N$7
  Top 0.254: U4.2 37.11,20.36 37.13,20.34 39.14,20.34 39.39,20.09 | 39.39,20.09 X2.P$2 | C4.1 39.52,20.22 39.39,20.09
N$9
  Top 0.254: U1.4 19.1,20.6 18.38,21.32 L1.2
  pour Top (isolate 0.305, no thermals): 19,19.3 19,20.3 18.5,20.8 17.7,20.8 17.6,20.9 17.6,24.3 17.7,24.4 19,24.4 19.2,24.2 19.2,19.3
N$10
  Top 0.254: U1.2 20.11,22.16 L1.1
  pour Top (isolate 0.305, no thermals): 20,19.3 20,24.3 20.1,24.4 21.2,24.4 21.3,24.3 21.3,21.1 20.2,20 20.2,19.3
N$14
  Top 0.254: U2.12 28.4,12.6 29.1,11.9 R15.1
SCK  (via drill 0.35)
  Top 0.254: U4.20 32.1,27.6 32.37,27.87 32.37,31.63 33.99,33.24 50.9,33.24 52.34,31.8 52.34,26.74 51.9,26.3 49.51,26.3 X4.5 44.18,26.27 v43.6,25.7
  Bottom 0.254: v43.6,25.7 43.35,25.45
SCL  (via drill 0.35)
  Top 0.254: U4.32 26.55,21.86 v26.4,22.02 | v27.7,15.8 27.55,15.65 26.3,15.65
  Top 0.406: U2.14 26.3,15.65 R17.2
  Bottom 0.254: v26.4,22.02 25.42,22.02 25.2,21.8 25.2,17.6 25.8,17 26.9,17 27.7,16.2 v27.7,15.8
SDA  (via drill 0.35)
  Top 0.254: U2.13 29.05,13.4 R16.2 30.35,13.25 v30.5,13.4 | v27.6,22.8 28.02,22.8 28.46,22.36 U4.31
  Bottom 0.254: v30.5,13.4 30.5,14.1 27.2,17.4 27.2,22.4 v27.6,22.8
SWCLK  (via drill 0.35)
  Top 0.254: J1.4 49.25,14.05 49,13.8 48.99,13.81 R1.1 45.84,15.71 v45.5,16.05 | U4.45 34.09,17.11 v34.35,16.85
  Bottom 0.254: v34.35,16.85 35.16,16.05 v45.5,16.05
SWDIO  (via drill 0.35)
  Top 0.254: U4.46 34.6,17.88 v34.99,17.49 | v46.4,16.7 47.7,16.7 48,16.4 47.98,16.38 J1.2
  Bottom 0.254: v34.99,17.49 35.78,16.7 v46.4,16.7
V+
  Top 0.305: D2.A 12.38,10.38 12.6,10.6 12.56,10.64 U3.4 | 19.5,16.7 U1.8
  Top 0.406: X3.VBUS 7.2,11.09 7.7,10.6 7.7,9.62 8.31,9 10.5,9 | 10.5,9 10.8,9 | 10.8,9 11.1,9 | 11.1,9 15.1,9 17.5,11.4 17.5,16.3 | 10.8,9 10.8,9.3 | D2.A 10.8,9.3 | 10.8,9.3 11.1,9 | 10.8,9.3 10.5,9 | 19.5,16.7 U1.6 17.9,16.7 | 17.5,16.3 17.5,16.7 | 17.5,16.7 17.5,17.1 | 17.5,17.1 17.5,19.1 | 18.54,19.65 18.49,19.7 18,19.7 18,19.6 17.5,19.1 | 17.5,19.1 16.74,19.86 C12.1 | 17.9,16.7 17.5,16.7 | 17.5,16.3 17.9,16.7 | 17.5,17.1 17.9,16.7 | 17.9,16.7
  Top 0.813: D1.C 15.28,22.62 16.33,21.57 C12.1
  pour Top (no thermals): 18.6,19.3 15.8,19.3 15.6,19.5 15.6,20.5 15.7,20.6 17,20.6 17.6,20 18.6,20 18.7,19.9 18.7,19.4
  pour Top (isolate 0.305, no thermals): 17.4,16.9 19.6,16.9 19.7,16.8 19.7,15.6 18.6,14.5 17.4,14.5 17.3,14.6 17.3,16.8
V_BATT
  Top 0.254: 11.08,20.59 10.9,20.77 | 10.9,20.77 10.65,21.02 D1.A | 10.9,20.4 10.9,20.77
  Top 0.406: U3.3 12.56,16.04 | 12.56,16.04 C3.1 | R3.1 11.08,20.59 10.9,20.4 10.3,19.8 10.3,16.4 10.6,16.1 12.5,16.1 12.56,16.04
  Top 0.813: X1.1 10.55,22.72 D1.A
VDDCORE
  Top 0.254: C1.1 33.1,17.7 33.11,17.71 33.11,19.12 U4.43

### Text on the board
tNames: 3V3 | GND | 3V3 | 3V3 | OUT | 3V3 | BCLK | DOUT | LRCLK | D11 | RX | D13 | TX | GND | 1 | CHG | RST | 1 | designed by | GPS Sensor v0.1